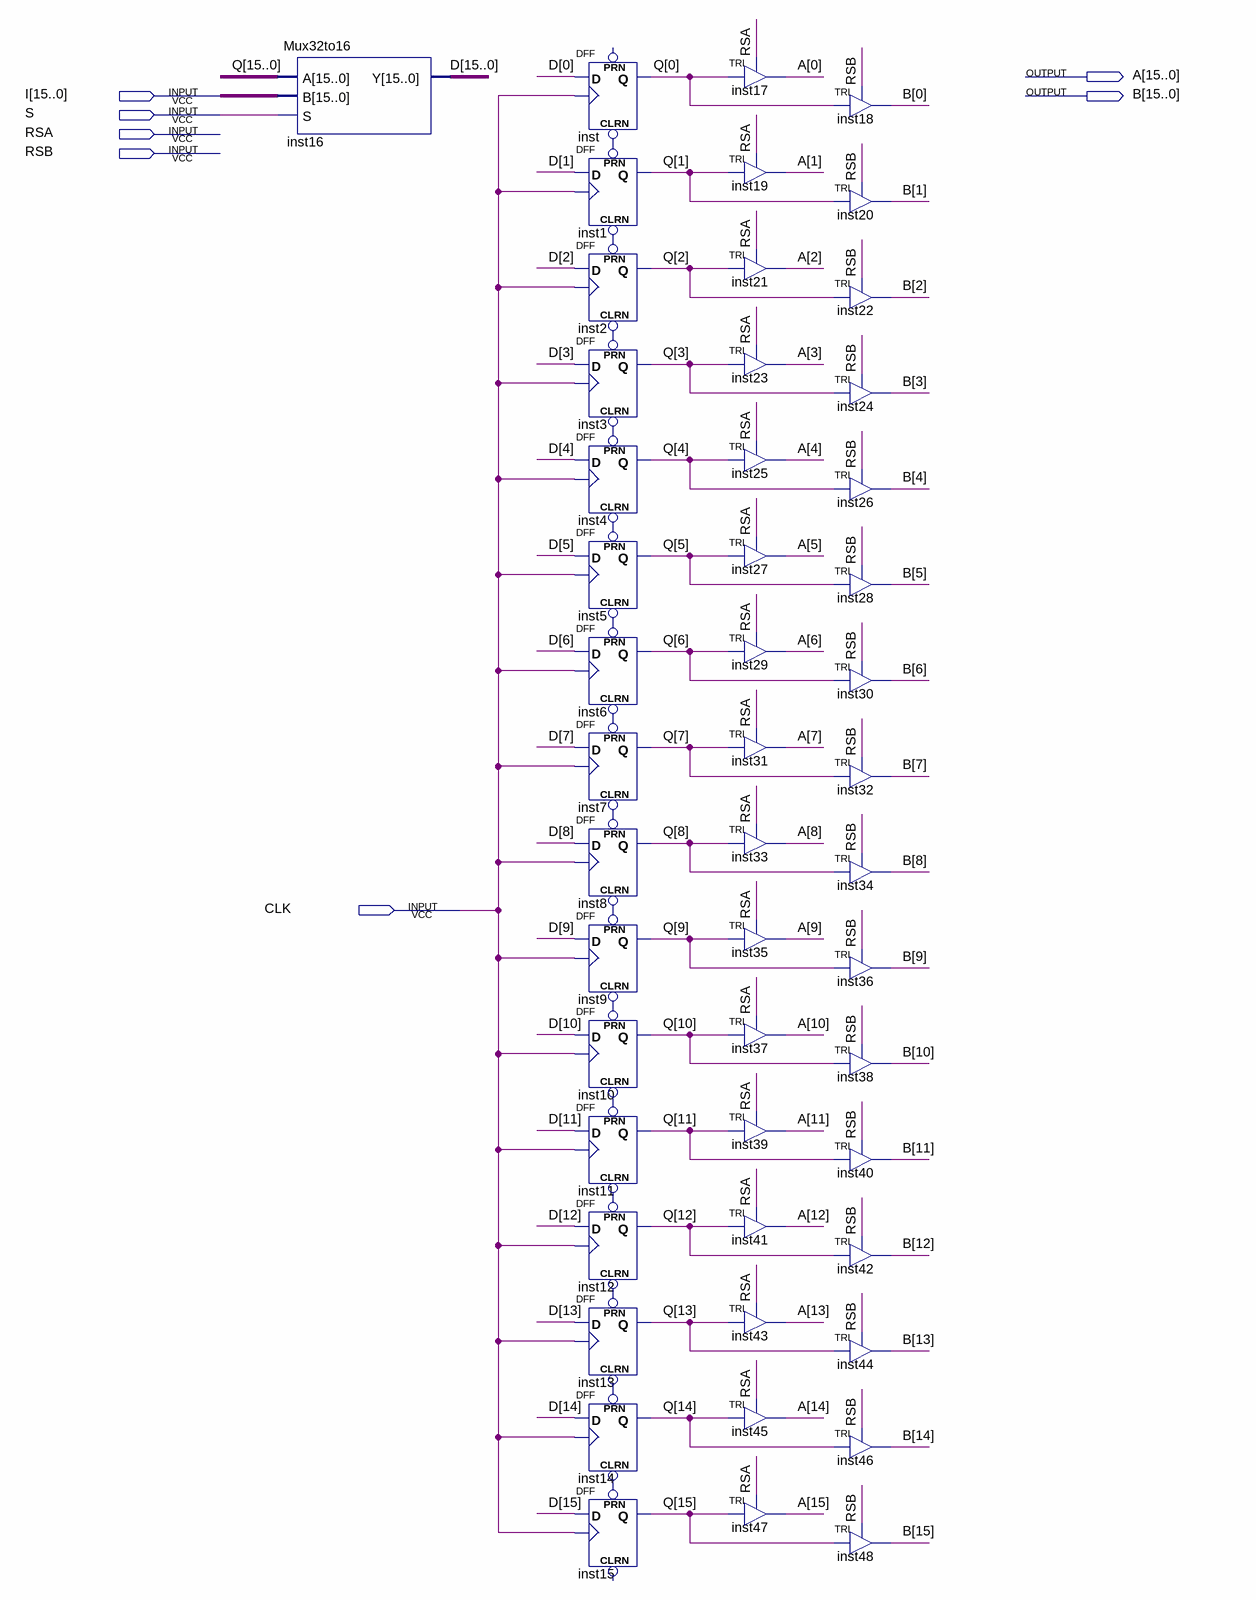
[diagram p0: schematic sheet]
// Quartus schematic RF16bit.bdf as structural Verilog: 49 symbols, 7 pins
module RF16bit (
  input  [15:0] I,
  input  S,
  input  RSA,
  input  RSB,
  input  CLK,
  output [15:0] A,
  output [15:0] B
);

  wire undriven, undriven_2, undriven_3, undriven_4, undriven_5, undriven_6, undriven_7, undriven_8,
       undriven_9, undriven_10, undriven_11, undriven_12, undriven_13, undriven_14, undriven_15;
  wire [15:0] D, Q;

  Mux32to16 inst16 (.A(Q), .B(I), .S(S), .Y(D));
  DFF inst (.CLRN(undriven), .CLK(CLK), .D(D[0]), .Q(Q[0]));  // open: PRN
  DFF inst1 (.CLRN(undriven_2), .CLK(CLK), .D(D[1]), .PRN(undriven), .Q(Q[1]));
  DFF inst2 (.CLRN(undriven_3), .CLK(CLK), .D(D[2]), .PRN(undriven_2), .Q(Q[2]));
  DFF inst3 (.CLRN(undriven_4), .CLK(CLK), .D(D[3]), .PRN(undriven_3), .Q(Q[3]));
  DFF inst4 (.CLRN(undriven_5), .CLK(CLK), .D(D[4]), .PRN(undriven_4), .Q(Q[4]));
  DFF inst5 (.CLRN(undriven_6), .CLK(CLK), .D(D[5]), .PRN(undriven_5), .Q(Q[5]));
  DFF inst6 (.CLRN(undriven_7), .CLK(CLK), .D(D[6]), .PRN(undriven_6), .Q(Q[6]));
  DFF inst7 (.CLRN(undriven_8), .CLK(CLK), .D(D[7]), .PRN(undriven_7), .Q(Q[7]));
  DFF inst8 (.CLRN(undriven_9), .CLK(CLK), .D(D[8]), .PRN(undriven_8), .Q(Q[8]));
  DFF inst9 (.CLRN(undriven_10), .CLK(CLK), .D(D[9]), .PRN(undriven_9), .Q(Q[9]));
  DFF inst10 (.CLRN(undriven_11), .CLK(CLK), .D(D[10]), .PRN(undriven_10), .Q(Q[10]));
  DFF inst11 (.CLRN(undriven_12), .CLK(CLK), .D(D[11]), .PRN(undriven_11), .Q(Q[11]));
  DFF inst12 (.CLRN(undriven_13), .CLK(CLK), .D(D[12]), .PRN(undriven_12), .Q(Q[12]));
  DFF inst13 (.CLRN(undriven_14), .CLK(CLK), .D(D[13]), .PRN(undriven_13), .Q(Q[13]));
  DFF inst14 (.CLRN(undriven_15), .CLK(CLK), .D(D[14]), .PRN(undriven_14), .Q(Q[14]));
  DFF inst15 (.CLK(CLK), .D(D[15]), .PRN(undriven_15), .Q(Q[15]));  // open: CLRN
  TRI inst17 (.IN(Q[0]), .OE(RSA), .OUT(A[0]));
  TRI inst19 (.IN(Q[1]), .OE(RSA), .OUT(A[1]));
  TRI inst21 (.IN(Q[2]), .OE(RSA), .OUT(A[2]));
  TRI inst23 (.IN(Q[3]), .OE(RSA), .OUT(A[3]));
  TRI inst25 (.IN(Q[4]), .OE(RSA), .OUT(A[4]));
  TRI inst27 (.IN(Q[5]), .OE(RSA), .OUT(A[5]));
  TRI inst29 (.IN(Q[6]), .OE(RSA), .OUT(A[6]));
  TRI inst31 (.IN(Q[7]), .OE(RSA), .OUT(A[7]));
  TRI inst33 (.IN(Q[8]), .OE(RSA), .OUT(A[8]));
  TRI inst35 (.IN(Q[9]), .OE(RSA), .OUT(A[9]));
  TRI inst37 (.IN(Q[10]), .OE(RSA), .OUT(A[10]));
  TRI inst39 (.IN(Q[11]), .OE(RSA), .OUT(A[11]));
  TRI inst41 (.IN(Q[12]), .OE(RSA), .OUT(A[12]));
  TRI inst43 (.IN(Q[13]), .OE(RSA), .OUT(A[13]));
  TRI inst45 (.IN(Q[14]), .OE(RSA), .OUT(A[14]));
  TRI inst47 (.IN(Q[15]), .OE(RSA), .OUT(A[15]));
  TRI inst18 (.IN(Q[0]), .OE(RSB), .OUT(B[0]));
  TRI inst20 (.IN(Q[1]), .OE(RSB), .OUT(B[1]));
  TRI inst22 (.IN(Q[2]), .OE(RSB), .OUT(B[2]));
  TRI inst24 (.IN(Q[3]), .OE(RSB), .OUT(B[3]));
  TRI inst26 (.IN(Q[4]), .OE(RSB), .OUT(B[4]));
  TRI inst28 (.IN(Q[5]), .OE(RSB), .OUT(B[5]));
  TRI inst30 (.IN(Q[6]), .OE(RSB), .OUT(B[6]));
  TRI inst32 (.IN(Q[7]), .OE(RSB), .OUT(B[7]));
  TRI inst34 (.IN(Q[8]), .OE(RSB), .OUT(B[8]));
  TRI inst36 (.IN(Q[9]), .OE(RSB), .OUT(B[9]));
  TRI inst38 (.IN(Q[10]), .OE(RSB), .OUT(B[10]));
  TRI inst40 (.IN(Q[11]), .OE(RSB), .OUT(B[11]));
  TRI inst42 (.IN(Q[12]), .OE(RSB), .OUT(B[12]));
  TRI inst44 (.IN(Q[13]), .OE(RSB), .OUT(B[13]));
  TRI inst46 (.IN(Q[14]), .OE(RSB), .OUT(B[14]));
  TRI inst48 (.IN(Q[15]), .OE(RSB), .OUT(B[15]));
endmodule
